# EAGLE schematic d11_usb_std (EAGLE 7.3.0)
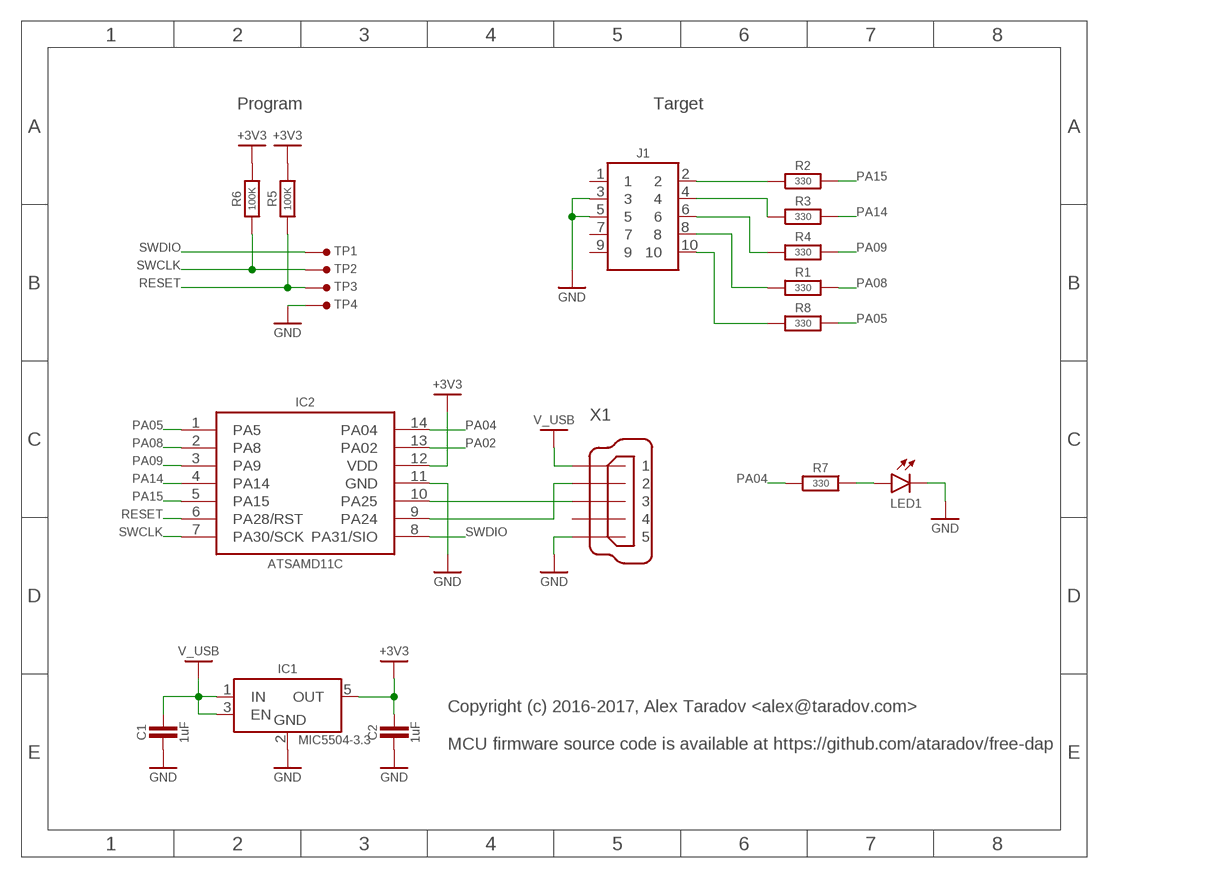
[diagram p0: schematic, sheet 1]

## Parts
C1  1uF  C-0603  [SMD0603]
C2  1uF  C-0603  [SMD0603]
IC1  MIC5504-3.3  MIC5504-SOT23-5  [SOT23-5]
IC2  ATSAMD11C  [SO-14]
J1  HEADER-5X2-TH-1.27  [HEADER-5X2-1.27MM]
LED1  LED_SMDLED_0603  [SMD0603]
R1  330  R-0603  [SMD0603]
R2  330  R-0603  [SMD0603]
R3  330  R-0603  [SMD0603]
R4  330  R-0603  [SMD0603]
R5  100K  R-0603  [SMD0603]
R6  100K  R-0603  [SMD0603]
R7  330  R-0603  [SMD0603]
R8  330  R-0603  [SMD0603]
TP1  SIO  TEST-POINT-1.27MM  [TP-1.27MM]
TP2  TEST-POINT-1.27MM  [TP-1.27MM]
TP3  TEST-POINT-1.27MM  [TP-1.27MM]
TP4  TEST-POINT-1.27MM  [TP-1.27MM]
X1  MINI-USB-32005-201  [32005-201]

## Nets
+3V3: C2.2 IC1.5(OUT) IC2.12(VDD) R5.2 R6.2
GND: C1.1 C2.1 IC1.2(GND) IC2.11(GND) J1.3 J1.5 LED1.2(C) TP4.1 X1.5
N$1: IC2.9(PA24) X1.2
N$2: IC2.10(PA25) X1.3
N$3: LED1.1(A) R7.2
N$5: J1.2 R2.1
N$9: J1.4 R3.1
N$10: J1.6 R4.1
N$11: J1.8 R1.1
N$12: J1.10 R8.1
PA02: IC2.13(PA02)
PA04: IC2.14(PA04) R7.1
PA05: IC2.1(PA5) R8.2
PA08: IC2.2(PA8) R1.2
PA09: IC2.3(PA9) R4.2
PA14: IC2.4(PA14) R3.2
PA15: IC2.5(PA15) R2.2
RESET: IC2.6(PA28/RST) R5.1 TP3.1
SWCLK: IC2.7(PA30/SCK) R6.1 TP2.1
SWDIO: IC2.8(PA31/SIO) TP1.1
V_USB: C1.2 IC1.1(IN) IC1.3(EN) X1.1
Unconnected: J1.1 J1.7 J1.9 X1.4

## Notes on the sheet
- Program | Target
- Copyright (c) 2016-2017, Alex Taradov <alex@taradov.com>
  
  MCU firmware source code is available at https://github.com/ataradov/free-dap

## Library data of the parts
C1 C2 = ataradov_rlc:C
IC1 = ataradov_vreg:MIC5504: LM1117 voltage regulator
IC2 = ataradov_mcu:ATSAMD11C
J1 = ataradov_conn:HEADER-5X2
LED1 = ataradov_led:LED_SMD: SMD_LED
R1-R8 = ataradov_rlc:R
TP1-TP4 = ataradov_misc:TEST-POINT: Test Point
X1 = con-cypressindustries:MINI-USB-: MINI USB-B Conector Source: www.cypressindustries.com; OC_FARNELL: unknown; OC_NEWARK: unknown